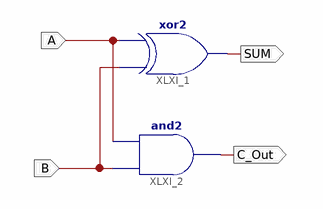
[diagram p0: schematic sheet 1]
// Xilinx ISE schematic myHalf_add.sch (xc9500) as structural Verilog: 2 symbols, 4 ports
module myHalf_add (
  input  A,
  input  B,
  output SUM,
  output C_Out
);

  xor XLXI_1 (SUM, B, A);
  and XLXI_2 (C_Out, B, A);
endmodule
